# Altium schematic sheet HYDRA_V3_RECOVERY.SchDoc
size C; SheetNumber: 1; SheetTotal: 6
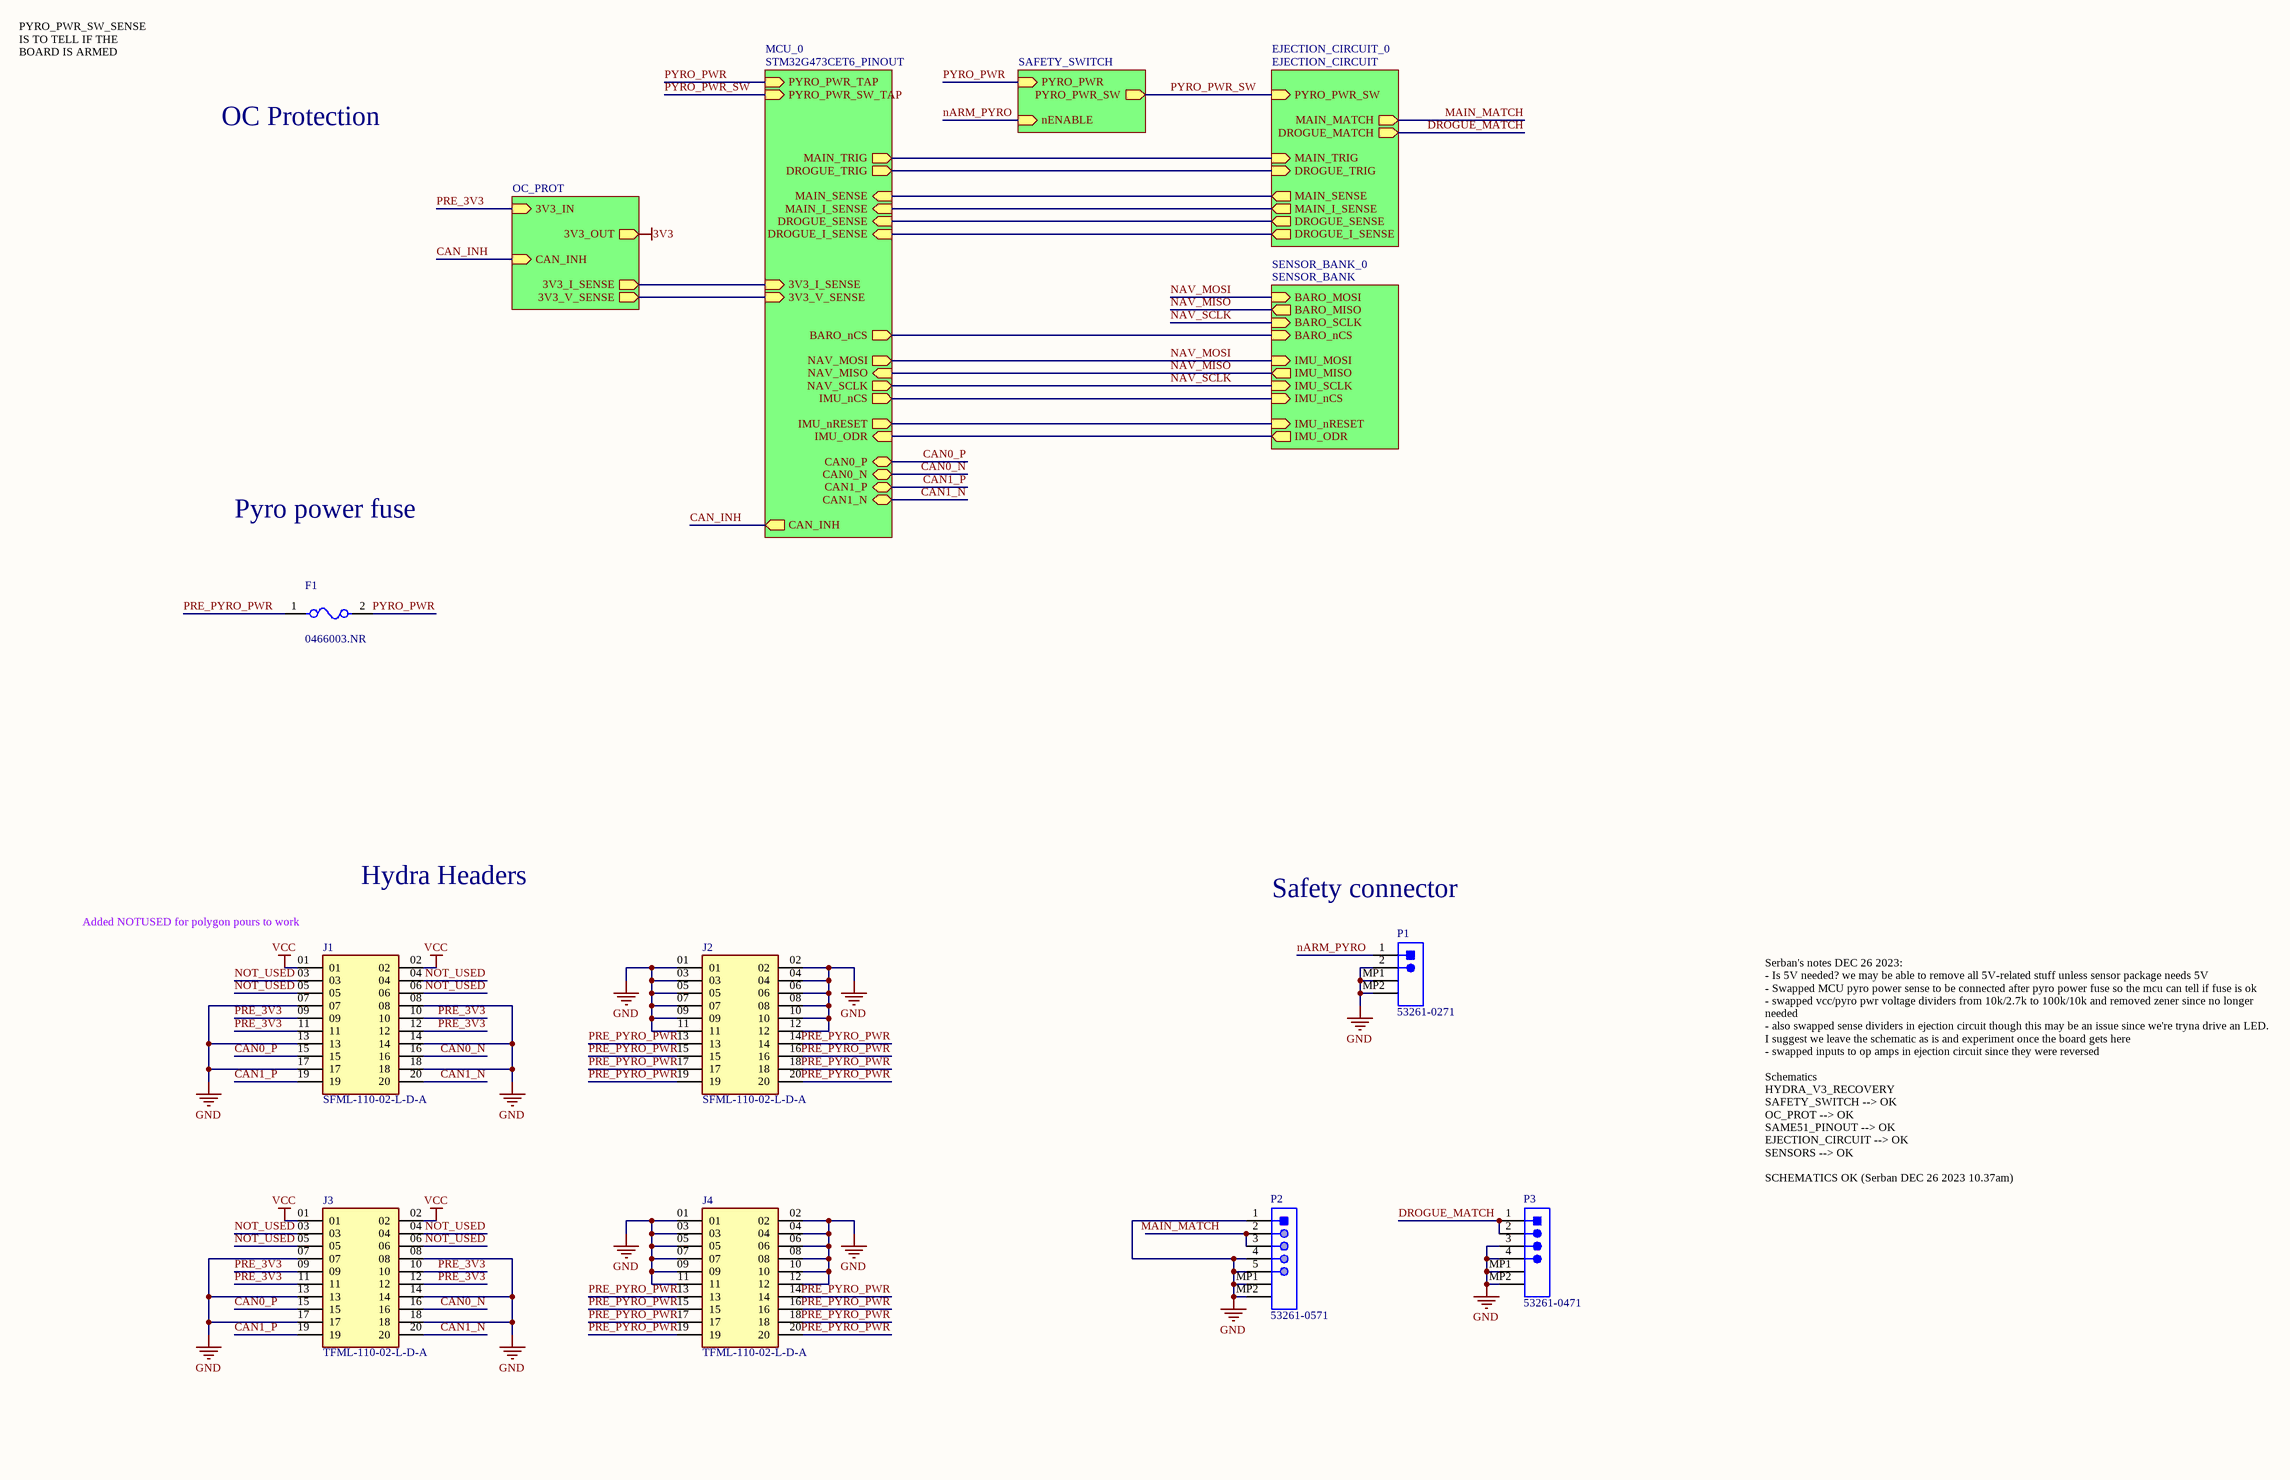
[diagram p0: HYDRA_V3_RECOVERY.SchDoc]

## Parts
F1  0466003.NR  [FP-0466-MFG]
J1  SFML-110-02-L-D-A  [SFML-110-02-L-D-A-Footprint-1]
J2  SFML-110-02-L-D-A  [SFML-110-02-L-D-A-Footprint-1]
J3  TFML-110-02-L-D-A  [TFML-110-02-L-D-A-Footprint-1]
J4  TFML-110-02-L-D-A  [TFML-110-02-L-D-A-Footprint-1]
P1  53261-0271  [MOLX-53261-0271_V]
P2  53261-0571  [MOLX-52361-0571-5_V]
P3  53261-0471  [MOLEX-53261-0471_V]

## Sub-sheets
EJECTION_CIRCUIT_0 = EJECTION_CIRCUIT: MAIN_TRIG (in), DROGUE_TRIG (in), PYRO_PWR_SW (in), MAIN_SENSE (out), DROGUE_SENSE (out), MAIN_I_SENSE (out), DROGUE_I_SENSE (out), MAIN_MATCH (out), DROGUE_MATCH (out)
MCU_0 = STM32G473CET6_PINOUT: MAIN_TRIG (out), DROGUE_TRIG (out), MAIN_SENSE (in), MAIN_I_SENSE (in), DROGUE_SENSE (in), DROGUE_I_SENSE (in), BARO_nCS (out), IMU_nCS (out), IMU_nRESET (out), IMU_ODR (in), CAN0_P (bidir), CAN0_N (bidir), CAN1_P (bidir), CAN1_N (bidir), CAN_INH (out), NAV_MOSI (out), NAV_MISO (in), NAV_SCLK (out), 3V3_I_SENSE (in), 3V3_V_SENSE (in), PYRO_PWR_TAP (in), PYRO_PWR_SW_TAP (in)
OC_PROT = OC_PROT: 3V3_IN (in), 3V3_OUT (out), CAN_INH (in), 3V3_I_SENSE (out), 3V3_V_SENSE (out)
SAFETY_SWITCH_0 = SAFETY_SWITCH: PYRO_PWR (in), PYRO_PWR_SW (out), nENABLE (in)
SENSOR_BANK_0 = SENSOR_BANK: IMU_MOSI (in), IMU_MISO (out), IMU_ODR (out), IMU_nCS (in), IMU_SCLK (in), IMU_nRESET (in), BARO_SCLK (in), BARO_MOSI (in), BARO_MISO (out), BARO_nCS (in)

## Nets
3V3: sheet OC_PROT/3V3_OUT
GND: J1.07 J1.08 J1.13 J1.14 J1.17 J1.18 J2.01 J2.02 J2.03 J2.04 J2.05 J2.06 J2.07 J2.08 J2.09 J2.10 J2.11 J2.12 J3.07 J3.08 J3.13 J3.14 J3.17 J3.18 J4.01 J4.02 J4.03 J4.04 J4.05 J4.06 J4.07 J4.08 J4.09 J4.10 J4.11 J4.12 P1.2 P1.MP1 P1.MP2 P2.1 P2.4 P2.5 P2.MP1 P2.MP2 P3.3 P3.4 P3.MP1 P3.MP2
VCC: J1.01 J1.02 J3.01 J3.02
CAN0_N: J1.16 J3.16 ; sheet MCU_0/CAN0_N
CAN0_P: J1.15 J3.15 ; sheet MCU_0/CAN0_P
CAN1_N: J1.20 J3.20 ; sheet MCU_0/CAN1_N
CAN1_P: J1.19 J3.19 ; sheet MCU_0/CAN1_P
CAN_INH: sheet OC_PROT/CAN_INH, sheet MCU_0/CAN_INH
DROGUE_MATCH: P3.1 P3.2 ; sheet EJECTION_CIRCUIT_0/DROGUE_MATCH
MAIN_MATCH: P2.2 P2.3 ; sheet EJECTION_CIRCUIT_0/MAIN_MATCH
nARM_PYRO: P1.1 ; sheet SAFETY_SWITCH_0/nENABLE
NAV_MISO: sheet MCU_0/NAV_MISO, sheet SENSOR_BANK_0/IMU_MISO, sheet SENSOR_BANK_0/BARO_MISO
NAV_MOSI: sheet MCU_0/NAV_MOSI, sheet SENSOR_BANK_0/IMU_MOSI, sheet SENSOR_BANK_0/BARO_MOSI
NAV_SCLK: sheet MCU_0/NAV_SCLK, sheet SENSOR_BANK_0/IMU_SCLK, sheet SENSOR_BANK_0/BARO_SCLK
NOT_USED: J1.03 J1.04 J1.05 J1.06 J3.03 J3.04 J3.05 J3.06
PRE_3V3: J1.09 J1.10 J1.11 J1.12 J3.09 J3.10 J3.11 J3.12 ; sheet OC_PROT/3V3_IN
PRE_PYRO_PWR: F1.1 J2.13 J2.14 J2.15 J2.16 J2.17 J2.18 J2.19 J2.20 J4.13 J4.14 J4.15 J4.16 J4.17 J4.18 J4.19 J4.20
PYRO_PWR: F1.2 ; sheet MCU_0/PYRO_PWR_TAP, sheet SAFETY_SWITCH_0/PYRO_PWR
PYRO_PWR_SW: sheet MCU_0/PYRO_PWR_SW_TAP, sheet EJECTION_CIRCUIT_0/PYRO_PWR_SW, sheet SAFETY_SWITCH_0/PYRO_PWR_SW
(unnamed): sheet OC_PROT/3V3_I_SENSE, sheet MCU_0/3V3_I_SENSE
(unnamed): sheet OC_PROT/3V3_V_SENSE, sheet MCU_0/3V3_V_SENSE
(unnamed): sheet MCU_0/MAIN_TRIG, sheet EJECTION_CIRCUIT_0/MAIN_TRIG
(unnamed): sheet MCU_0/DROGUE_TRIG, sheet EJECTION_CIRCUIT_0/DROGUE_TRIG
(unnamed): sheet MCU_0/MAIN_SENSE, sheet EJECTION_CIRCUIT_0/MAIN_SENSE
(unnamed): sheet MCU_0/MAIN_I_SENSE, sheet EJECTION_CIRCUIT_0/MAIN_I_SENSE
(unnamed): sheet MCU_0/DROGUE_SENSE, sheet EJECTION_CIRCUIT_0/DROGUE_SENSE
(unnamed): sheet MCU_0/DROGUE_I_SENSE, sheet EJECTION_CIRCUIT_0/DROGUE_I_SENSE
(unnamed): sheet MCU_0/BARO_nCS, sheet SENSOR_BANK_0/BARO_nCS
(unnamed): sheet MCU_0/IMU_nCS, sheet SENSOR_BANK_0/IMU_nCS
(unnamed): sheet MCU_0/IMU_nRESET, sheet SENSOR_BANK_0/IMU_nRESET
(unnamed): sheet MCU_0/IMU_ODR, sheet SENSOR_BANK_0/IMU_ODR

## Notes on the sheet
- PYRO_PWR_SW_SENSE IS TO TELL IF THE BOARD IS ARMED
- OC Protection
- Pyro power fuse
- Hydra Headers
- Safety connector
- (near J1) Added NOTUSED for polygon pours to work
- Serban's notes DEC 26 2023:
  - Is 5V needed? we may be able to remove all 5V-related stuff unless sensor package needs 5V
  - Swapped MCU pyro power sense to be connected after pyro power fuse so the mcu can tell if fuse is ok
  - swapped vcc/pyro pwr voltage dividers from 10k/2.7k to 100k/10k and removed zener since no longer needed
  - also swapped sense dividers in ejection circuit though this may be an issue since we're tryna drive an LED. I suggest we leave the schematic as is and experiment once the board gets here
  - swapped inputs to op amps in ejection circuit since they were reversed
  Schematics
  HYDRA_V3_RECOVERY
  SAFETY_SWITCH --> OK
  OC_PROT --> OK
  SAME51_PINOUT --> OK
  EJECTION_CIRCUIT --> OK
  SENSORS --> OK
  SCHEMATICS OK (Serban DEC 26 2023 10.37am)

## Library data of the parts
F1 = CMP-08605-000054-1: FUSE BOARD MNT 3A 32VAC/VDC 1206; Manufacturer: Littelfuse; Fuse Interrupt Ac Current: 50A; Fuse Voltage Drop: 75.99mV; Max Fuse Ac Voltage: 32V; Fuse I2T: 0.576A2Sec; Resistance: 0.019Ω; Fuse Blow Speed: Fast; Value: 0.019Ω; ComponentLink2Description: Datasheet; Fuse Current: 3A; RoHS: TRUE; Mouser Description: Surface Mount Fuses 32V 3A VFA Slimline; Height: 0.66mm; Octopart: https://octopart.com/0466003.nr-littelfuse-565175; Package: 0466; Fuse Interrupt Dc Current: 50A; Manufacturer Part Number: 0466003.NR; Temperature Range Low: -55°C; ComponentLink2URL: https://www.littelfuse.com/~/media/electronics/datasheets/fuses/littelfuse_fuse_466_datasheet.pdf.pdf; Digikey Description: FUSE BOARD MNT 3A 32VAC/VDC 1206; Voltage Rating: 32V; Category: Fuse; Lead Free: Yes; Device Class L2: Fuses; Automotive: No; Max Fuse Dc Voltage: 32V; Temperature Range High: +90°C; Device Class L3: unset; Device Class L1: Circuit Protection; Temperature: -55°C to +90°C
J1 J2 = CMP-002-00043-1: Board Connector, 20 Contact(s), 2 Row(s), Female, Straight, 0.05 inch Pitch, Surface Mount Terminal, Locking, Black Insulator, Socket; RoHS Compliant: Yes; Connector Type: BOARD CONNECTOR; Mounting Technology: Board
J3 J4 = CMP-002-00042-1: Board Connector, 20 Contact(s), 2 Row(s), Male, Straight, Surface Mount Terminal; Connector Type: BOARD CONNECTOR; Mounting Technology: Board; RoHS Compliant: Yes
P1 = CMP-2000-05633-1: PicoBlade(TM) Header, Right Angle, -40 to 85 degC, 2-Pin SMD, RoHS, Tape and Reel; Current - Max: 1A; Brand: Molex; Voltage Rating: 125V; Number of Positions: 2; Pitch: 1.25mm; Package Version: Rev. H, 11/2014; Factory Pack Quantity: 1000; Datasheet URL: http://www.molex.com/webdocs/datasheets/pdf/en-us/0532610271_PCB_HEADERS.pdf; Datasheet Version: 03/2016; Housing Material: Thermoplastic; RoHS: Details; Product Type: Headers; Number of Rows: 1; Termination Style: SMD; Mounting Technology: SurfaceMount; Number of Positions / Contacts: 2; Package URL: http://www.molex.com/pdm_docs/sd/532610271_sd.pdf; Mounting Angle: Right; Mounting Style: SMD/SMT; Manufacturer: Molex; Product Category: 1.25mmConnectors; Tradename: PicoBlade; Voltage - Max: 125V; Manufacturer URL: http://www.molex.com/; Series: 53261; Package Description: 2-Leads Header, Pitch 1.25 mm, Mated Height 3.4 mm; Package Reference: 53261-0271; Current Rating: 1A; Contact Plating: Tin; Contact Material: PhosphorBronze; Type: Shrouded; Packaging: Reel
P2 = CMP-2000-05249-1: Male Header, Pitch 1.25 mm, 1 x 5 Position, Height 3.4 mm, RoHS, Tape and Reel; Brand: Molex; Mounting Angle: Right; Number of Positions: 5; Voltage Rating: 125V; Current Rating: 1A; Pitch: 1.25mm; Datasheet Version: Rev. D, 04/2004; Housing Material: Thermoplastic; Series: 53261; RoHS: Details; Product Category: Headers&WireHousings; Datasheet URL: http://datasheet.octopart.com/532610571-Molex-datasheet-8343080.pdf; Manufacturer URL: http://www.molex.com/; Contact Material: PhosphorBronze; Tradename: PicoBlade; Number of Rows: 1; Product Type: Headers; Manufacturer: Molex; Type: Shrouded; Termination Style: SMD; Mounting Style: SMD/SMT; Factory Pack Quantity: 1000; Contact Plating: Tin; Packaging: Reel; Number of Positions / Contacts: 5
P3 = CMP-2000-05238-1: Male Header, Pitch 1.25 mm, 1 x 4 Position, Height 3.4 mm, -40 to 85 degC, RoHS, Tape and Reel; Current Rating: 1A; Brand: Molex; Number of Positions / Contacts: 4; Pitch: 1.25mm; Voltage Rating: 125V; Mounting Angle: Right; Manufacturer URL: http://www.molex.com/; Factory Pack Quantity: 1000; Housing Material: Thermoplastic; Datasheet URL: http://www.molex.com/pdm_docs/sd/532610471_sd.pdf; Tradename: PicoBlade; Product Type: Headers; Contact Plating: Tin; Contact Material: PhosphorBronze; Package Description: 1.25mm Pitch PicoBlade(TM) Header, Surface Mount, Right Angle, Lead-Free, 4 Circuits; Mounting Style: SMD/SMT; Manufacturer: Molex; Series: 53261; Packaging: Reel; Number of Rows: 1; RoHS: Details; Number of Positions: 4; Product Category: Headers&WireHousings; Datasheet Version: Rev. G, 01/2012; Type: Shrouded; Termination Style: SMD